# Altium schematic sheet Due_Breakout_Board.SchDoc: Due Breakout Board
size A; DocumentNumber: 1; SheetNumber: 1; SheetTotal: 3
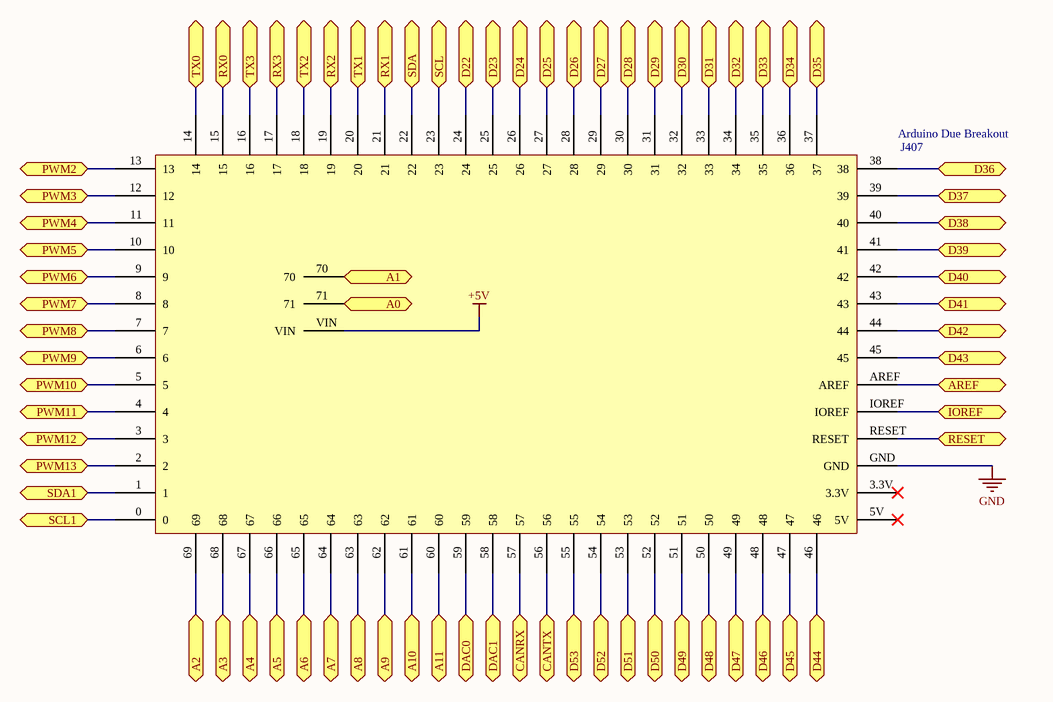
[diagram p0: Due_Breakout_Board.SchDoc]

## Parts
J407  Arduino Due Breakout  [DUE_BREAKOUT]

## Ports
A0, A1, A2, A3, A4, A5, A6, A7, A8, A9, A10, A11, AREF, CANRX, CANTX, D22, D23, D24, D25, D26, D27, D28, D29, D30, D31, D32, D33, D34, D35, D36, D37, D38, D39, D40, D41, D42, D43, D44, D45, D46, D47, D48, D49, D50, D51, D52, D53, DAC0, DAC1, IOREF, PWM2, PWM3, PWM4, PWM5, PWM6, PWM7, PWM8, PWM9, PWM10, PWM11, PWM12, PWM13, RESET, RX0, RX1, RX2, RX3, SCL, SCL1, SDA, SDA1, TX0, TX1, TX2, TX3

## Nets
+5V: J407.VIN
GND: J407.GND
A0: J407.71 ; port A0
A1: J407.70 ; port A1
A2: J407.69 ; port A2
A3: J407.68 ; port A3
A4: J407.67 ; port A4
A5: J407.66 ; port A5
A6: J407.65 ; port A6
A7: J407.64 ; port A7
A8: J407.63 ; port A8
A9: J407.62 ; port A9
A10: J407.61 ; port A10
A11: J407.60 ; port A11
AREF: J407.AREF ; port AREF
CANRX: J407.57 ; port CANRX
CANTX: J407.56 ; port CANTX
D22: J407.24 ; port D22
D23: J407.25 ; port D23
D24: J407.26 ; port D24
D25: J407.27 ; port D25
D26: J407.28 ; port D26
D27: J407.29 ; port D27
D28: J407.30 ; port D28
D29: J407.31 ; port D29
D30: J407.32 ; port D30
D31: J407.33 ; port D31
D32: J407.34 ; port D32
D33: J407.35 ; port D33
D34: J407.36 ; port D34
D35: J407.37 ; port D35
D36: J407.38 ; port D36
D37: J407.39 ; port D37
D38: J407.40 ; port D38
D39: J407.41 ; port D39
D40: J407.42 ; port D40
D41: J407.43 ; port D41
D42: J407.44 ; port D42
D43: J407.45 ; port D43
D44: J407.46 ; port D44
D45: J407.47 ; port D45
D46: J407.48 ; port D46
D47: J407.49 ; port D47
D48: J407.50 ; port D48
D49: J407.51 ; port D49
D50: J407.52 ; port D50
D51: J407.53 ; port D51
D52: J407.54 ; port D52
D53: J407.55 ; port D53
DAC0: J407.59 ; port DAC0
DAC1: J407.58 ; port DAC1
IOREF: J407.IOREF ; port IOREF
PWM2: J407.13 ; port PWM2
PWM3: J407.12 ; port PWM3
PWM4: J407.11 ; port PWM4
PWM5: J407.10 ; port PWM5
PWM6: J407.9 ; port PWM6
PWM7: J407.8 ; port PWM7
PWM8: J407.7 ; port PWM8
PWM9: J407.6 ; port PWM9
PWM10: J407.5 ; port PWM10
PWM11: J407.4 ; port PWM11
PWM12: J407.3 ; port PWM12
PWM13: J407.2 ; port PWM13
RESET: J407.RESET ; port RESET
RX0: J407.15 ; port RX0
RX1: J407.21 ; port RX1
RX2: J407.19 ; port RX2
RX3: J407.17 ; port RX3
SCL: J407.23 ; port SCL
SCL1: J407.0 ; port SCL1
SDA: J407.22 ; port SDA
SDA1: J407.1 ; port SDA1
TX0: J407.14 ; port TX0
TX1: J407.20 ; port TX1
TX2: J407.18 ; port TX2
TX3: J407.16 ; port TX3

Not connected (* = marked no-connect by the designer): J407 3.3V* 5V*

## Notes on the sheet
- Title
- Size:
- Date:
- A
- Number:
- Time:
- Revision:
- Sheet
- of
- File:

## Library data of the parts
J407 = Arduino_Due